# Altium schematic sheet CPU_DDR2.SchDoc: CPU_DDR2
size A4; Date: 18/06/2014; DrawnBy: J. Gabriel R.E.; Organization: Seven Solutions S.L.; Address1: C/Baza, Parcela 19, Nave 3; Address2: Polígono Ind. Juncaril; Address3: 18210-Peligros-Granada; Address4: Spain; Revision: 3.4; SheetNumber: 23; SheetTotal: 23; WebAddress: www.sevensols.com; Project: White Rabbit; ProjectName: White Rabbit
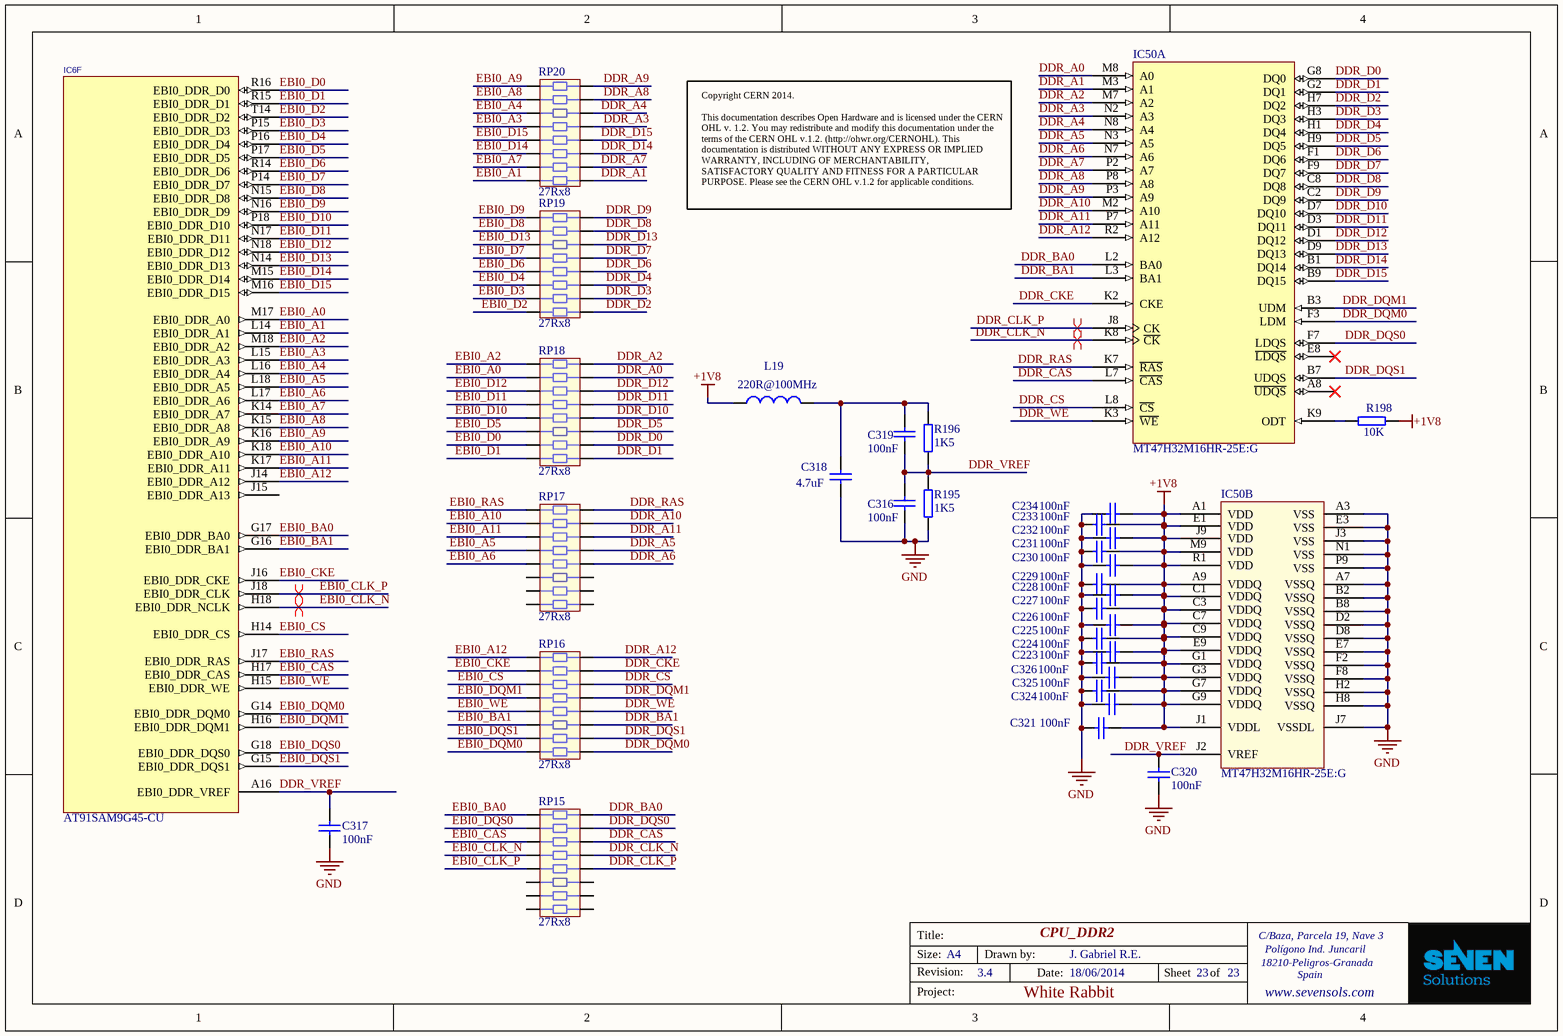
[diagram p0: CPU_DDR2.SchDoc]

## Parts
C223  100nF  [CC1005-0402]
C224  100nF  [CC1005-0402]
C225  100nF  [CC1005-0402]
C226  100nF  [CC1005-0402]
C227  100nF  [CC1005-0402]
C228  100nF  [CC1005-0402]
C229  100nF  [CC1005-0402]
C230  100nF  [CC1005-0402]
C231  100nF  [CC1005-0402]
C232  100nF  [CC1005-0402]
C233  100nF  [CC1005-0402]
C234  100nF  [CC1005-0402]
C316  100nF  [CC1005-0402]
C317  100nF  [CC1005-0402]
C318  4.7uF  [CC1608-0603]
C319  100nF  [CC1005-0402]
C320  100nF  [CC1005-0402]
C321  100nF  [CC1005-0402]
C324  100nF  [CC1005-0402]
C325  100nF  [CC1005-0402]
C326  100nF  [CC1005-0402]
IC6  AT91SAM9G45-CU  [TFBGA324]  (part F of 12)
IC50  MT47H32M16HR-25E:G  [BGA90C80P9X15_1250X800X120]  (parts A,B of 2)
L19  Impedance: 220R@100MHz  [0603]  (hidden comment: 220R@100MHz Ferrite Bead)
R195  1K5  [0402]
R196  1K5  [0402]
R198  10K  [0402]
RP15  value 27Rx8  [RESCAXS50P160X380X60-16N]  (hidden comment: 27R x 8)
RP16  value 27Rx8  [RESCAXS50P160X380X60-16N]  (hidden comment: 27R x 8)
RP17  value 27Rx8  [RESCAXS50P160X380X60-16N]  (hidden comment: 27R x 8)
RP18  value 27Rx8  [RESCAXS50P160X380X60-16N]  (hidden comment: 27R x 8)
RP19  value 27Rx8  [RESCAXS50P160X380X60-16N]  (hidden comment: 27R x 8)
RP20  value 27Rx8  [RESCAXS50P160X380X60-16N]  (hidden comment: 27R x 8)

## Nets
+1V8: C223.1 C224.1 C225.1 C226.1 C227.1 C228.1 C229.1 C230.1 C231.1 C232.1 C233.1 C234.1 C321.1 C324.1 C325.1 C326.1 IC50.A1(VDD) IC50.A9(VDDQ) IC50.C1(VDDQ) IC50.C3(VDDQ) IC50.C7(VDDQ) IC50.C9(VDDQ) IC50.E1(VDD) IC50.E9(VDDQ) IC50.G1(VDDQ) IC50.G3(VDDQ) IC50.G7(VDDQ) IC50.G9(VDDQ) IC50.J1(VDDL) IC50.J9(VDD) IC50.M9(VDD) IC50.R1(VDD) L19.1 R198.1
GND: C223.2 C224.2 C225.2 C226.2 C227.2 C228.2 C229.2 C230.2 C231.2 C232.2 C233.2 C234.2 C316.2 C317.2 C318.1 C320.2 C321.2 C324.2 C325.2 C326.2 IC50.A3(VSS) IC50.A7(VSSQ) IC50.B2(VSSQ) IC50.B8(VSSQ) IC50.D2(VSSQ) IC50.D8(VSSQ) IC50.E3(VSS) IC50.E7(VSSQ) IC50.F2(VSSQ) IC50.F8(VSSQ) IC50.H2(VSSQ) IC50.H8(VSSQ) IC50.J3(VSS) IC50.J7(VSSDL) IC50.N1(VSS) IC50.P9(VSS) R195.1
DDR_A0: IC50.M8(A0) RP18.15
DDR_A1: IC50.M3(A1) RP20.16
DDR_A2: IC50.M7(A2) RP18.16
DDR_A3: IC50.N2(A3) RP20.12
DDR_A4: IC50.N8(A4) RP20.11
DDR_A5: IC50.N3(A5) RP17.13
DDR_A6: IC50.N7(A6) RP17.12
DDR_A7: IC50.P2(A7) RP20.15
DDR_A8: IC50.P8(A8) RP20.10
DDR_A9: IC50.P3(A9) RP20.9
DDR_A10: IC50.M2(A10) RP17.15
DDR_A11: IC50.P7(A11) RP17.14
DDR_A12: IC50.R2(A12) RP16.16
DDR_BA0: IC50.L2(BA0) RP15.16
DDR_BA1: IC50.L3(BA1) RP16.11
DDR_CAS: IC50.L7(~{CAS}) RP15.14
DDR_CKE: IC50.K2(CKE) RP16.15
DDR_CLK_N: IC50.K8(~{CK}) RP15.13
DDR_CLK_P: IC50.J8(CK) RP15.12
DDR_CS: IC50.L8(~{CS}) RP16.14
DDR_D0: IC50.G8(DQ0) RP18.10
DDR_D1: IC50.G2(DQ1) RP18.9
DDR_D2: IC50.H7(DQ2) RP19.16
DDR_D3: IC50.H3(DQ3) RP19.15
DDR_D4: IC50.H1(DQ4) RP19.14
DDR_D5: IC50.H9(DQ5) RP18.11
DDR_D6: IC50.F1(DQ6) RP19.13
DDR_D7: IC50.F9(DQ7) RP19.12
DDR_D8: IC50.C8(DQ8) RP19.10
DDR_D9: IC50.C2(DQ9) RP19.9
DDR_D10: IC50.D7(DQ10) RP18.12
DDR_D11: IC50.D3(DQ11) RP18.13
DDR_D12: IC50.D1(DQ12) RP18.14
DDR_D13: IC50.D9(DQ13) RP19.11
DDR_D14: IC50.B1(DQ14) RP20.14
DDR_D15: IC50.B9(DQ15) RP20.13
DDR_DQM0: IC50.F3(LDM) RP16.9
DDR_DQM1: IC50.B3(UDM) RP16.13
DDR_DQS0: IC50.F7(LDQS) RP15.15
DDR_DQS1: IC50.B7(UDQS) RP16.10
DDR_RAS: IC50.K7(~{RAS}) RP17.16
DDR_VREF: C316.1 C317.1 C319.2 C320.1 IC6.A16(EBI0_DDR_VREF) IC50.J2(VREF) R195.2 R196.1
DDR_WE: IC50.K3(~{WE}) RP16.12
EBI0_A0: IC6.M17(EBI0_DDR_A0) RP18.2
EBI0_A1: IC6.L14(EBI0_DDR_A1) RP20.1
EBI0_A2: IC6.M18(EBI0_DDR_A2) RP18.1
EBI0_A3: IC6.L15(EBI0_DDR_A3) RP20.5
EBI0_A4: IC6.L16(EBI0_DDR_A4) RP20.6
EBI0_A5: IC6.L18(EBI0_DDR_A5) RP17.4
EBI0_A6: IC6.L17(EBI0_DDR_A6) RP17.5
EBI0_A7: IC6.K14(EBI0_DDR_A7) RP20.2
EBI0_A8: IC6.K15(EBI0_DDR_A8) RP20.7
EBI0_A9: IC6.K16(EBI0_DDR_A9) RP20.8
EBI0_A10: IC6.K18(EBI0_DDR_A10) RP17.2
EBI0_A11: IC6.K17(EBI0_DDR_A11) RP17.3
EBI0_A12: IC6.J14(EBI0_DDR_A12) RP16.1
EBI0_BA0: IC6.G17(EBI0_DDR_BA0) RP15.1
EBI0_BA1: IC6.G16(EBI0_DDR_BA1) RP16.6
EBI0_CAS: IC6.H17(EBI0_DDR_CAS) RP15.3
EBI0_CKE: IC6.J16(EBI0_DDR_CKE) RP16.2
EBI0_CLK_N: IC6.H18(EBI0_DDR_NCLK) RP15.4
EBI0_CLK_P: IC6.J18(EBI0_DDR_CLK) RP15.5
EBI0_CS: IC6.H14(EBI0_DDR_CS) RP16.3
EBI0_D0: IC6.R16(EBI0_DDR_D0) RP18.7
EBI0_D1: IC6.R15(EBI0_DDR_D1) RP18.8
EBI0_D2: IC6.T14(EBI0_DDR_D2) RP19.1
EBI0_D3: IC6.P15(EBI0_DDR_D3) RP19.2
EBI0_D4: IC6.P16(EBI0_DDR_D4) RP19.3
EBI0_D5: IC6.P17(EBI0_DDR_D5) RP18.6
EBI0_D6: IC6.R14(EBI0_DDR_D6) RP19.4
EBI0_D7: IC6.P14(EBI0_DDR_D7) RP19.5
EBI0_D8: IC6.N15(EBI0_DDR_D8) RP19.7
EBI0_D9: IC6.N16(EBI0_DDR_D9) RP19.8
EBI0_D10: IC6.P18(EBI0_DDR_D10) RP18.5
EBI0_D11: IC6.N17(EBI0_DDR_D11) RP18.4
EBI0_D12: IC6.N18(EBI0_DDR_D12) RP18.3
EBI0_D13: IC6.N14(EBI0_DDR_D13) RP19.6
EBI0_D14: IC6.M15(EBI0_DDR_D14) RP20.3
EBI0_D15: IC6.M16(EBI0_DDR_D15) RP20.4
EBI0_DQM0: IC6.G14(EBI0_DDR_DQM0) RP16.8
EBI0_DQM1: IC6.H16(EBI0_DDR_DQM1) RP16.4
EBI0_DQS0: IC6.G18(EBI0_DDR_DQS0) RP15.2
EBI0_DQS1: IC6.G15(EBI0_DDR_DQS1) RP16.7
EBI0_RAS: IC6.J17(EBI0_DDR_RAS) RP17.1
EBI0_WE: IC6.H15(EBI0_DDR_WE) RP16.5
NetC318_2: C318.2 C319.1 L19.2 R196.2
NetIC50_K9: IC50.K9(ODT) R198.2

Not connected (* = marked no-connect by the designer): IC6 J15(EBI0_DDR_A13); IC50 A8(~{UDQS})* E8(~{LDQS})*; RP15 6 7 8 9 10 11; RP17 6 7 8 9 10 11

## Layout directives
differential pair: DDR_CLK_N, DDR_CLK_P, EBI0_CLK_N, EBI0_CLK_P

## Notes on the sheet
- Copyright CERN 2014.
  This documentation describes Open Hardware and is licensed under the CERN OHL v. 1.2. You may redistribute and modify this documentation under the terms of the CERN OHL v.1.2. (http://ohwr.org/CERNOHL). This documentation is distributed WITHOUT ANY EXPRESS OR IMPLIED WARRANTY, INCLUDING OF MERCHANTABILITY, SATISFACTORY QUALITY AND FITNESS FOR A PARTICULAR PURPOSE. Please see the CERN OHL v.1.2 for applicable conditions.
- Title:
- Size:
- Revision:
- A4
- Drawn by:
- Date:
- Sheet
- of
- Project:

## Library data of the parts
C223-C234 C316 C317 C319-C321 C324-C326 = CC0402_100NF_16V_10%_X7R: Capacitor; Manufacturer1: TDK; Manufacturer1 PN: C1005X7R1C104K; TC: X7R; Tolerance: ±10%; Voltage: 16V; Published: 8-Jun-2000; LatestRevisionDate: 17-Jul-2002; LatestRevisionNote: Re-released for DXP Platform.; PackageReference: RAD-0.3; Publisher: Altium Limited; Distributor1: Digikey; Distributor1 PN: 445-4952-1-ND; Case: 0402; Value: 100nF
C318 = CC0603_4.7UF_10V_10%_X5R: Capacitor; Manufacturer1: TDK; Manufacturer1 PN: C1608X5R1A475K; TC: X5R; Tolerance: ±10%; Voltage: 10V; Published: 8-Jun-2000; LatestRevisionDate: 17-Jul-2002; LatestRevisionNote: Re-released for DXP Platform.; PackageReference: RAD-0.3; Publisher: Altium Limited; Distributor1: Digikey; Distributor1 PN: 445-5170-1-ND; Case: 0603; Value: 4.7uF
IC6 = AT91SAM9G45-CU: Atmel 400MHz ARM926 MCU; Value: AT91SAM9G45-CU; Distributor1 PN: AT91SAM9G45-CU-ND; Distributor1: Digikey
IC50 = MT47H32M16: DDR2 SDRAM 8Mx16x4 Banks; Value: MT47H32M16HR-25E:G; Distributor1 PN: MT47H32M16HR-25E:G-ND; Distributor1: Digikey
L19 = L_FERRITE_BEAD: ferrite bead; Manufacturer1: Murata; Manufacturer1 PN: BLM18KG221SN1D; Current Rating: 2.2A; DCR: 50mOhm; Case: 0603; Distributor1: Digikey; Distributor1 PN: 490-5255-1-ND
R195 R196 = R0402_1K5_±1%_0.1W_100PPM: SMD Resistor; Manufacturer1: Panasonic; Manufacturer1 PN: ERJ-2RKF1501X; TCR: 100ppm; Power Rating: 0.1W; Tolerance: ±1%; Case: 0402; Distributor1: DigiKey; Distributor1 PN: P1.50KLCT-ND; Value: 1K5
R198 = R0402_10K_±1%_0.1W_100PPM: SMD Resistor; Manufacturer1: Panasonic; Manufacturer1 PN: ERJ-2RKF1002X; TCR: 100ppm; Power Rating: 0.1W; Tolerance: ±1%; Case: 0402; Distributor1: DigiKey; Distributor1 PN: P10.0KLCT-ND; Value: 10K
RP15-RP20 = RES_8xARRAY: 27R, 62.5mW Chip Resistor 8 Elements Array; Manufacturer1: Rohm; Manufacturer1 PN: MNR18E0APJ270; Tolerance: ±5%; TCR: 200ppm; Case: RESCAXS50P160X380X60-16N; Distributor1 PN: MNR18270CT-ND; Distributor1: DigiKey; Power Rating: 62.5mW